# EAGLE schematic Lab2 (EAGLE 6.2)
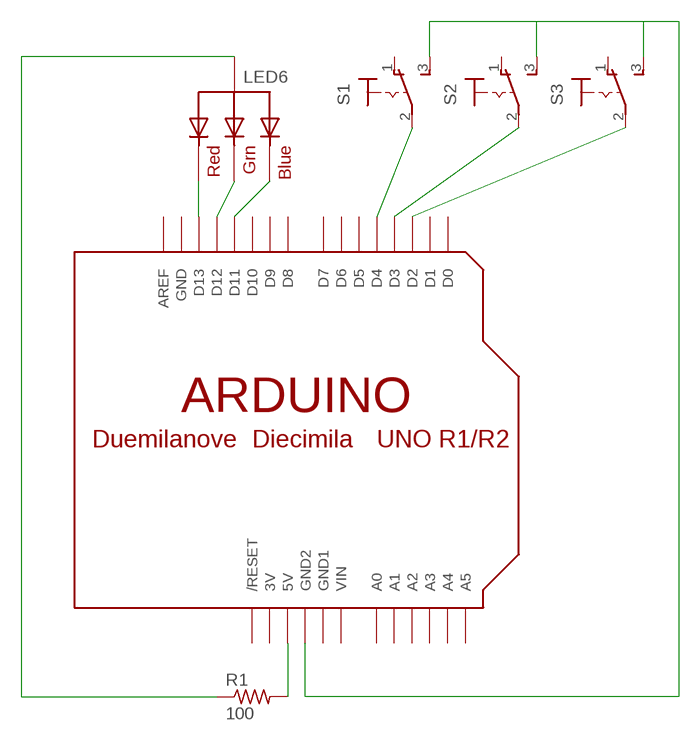
[diagram p0: schematic, sheet 1]

## Parts
LED6  RGBLED_CA-5MM  [LED5MMRGB]
R1  100  R-US_0411/12  [0411/12]
S1  M9040P  [M9040P]
S2  M9040P  [M9040P]
S3  M9040P  [M9040P]
U$1  ARDUINO-BPLACE  [ARDUINO-BPLACE]

## Nets
N$1: LED6.1(RED) U$1.D13
N$2: LED6.3(GREEN) U$1.D12
N$3: LED6.4(BLUE) U$1.D11
N$4: S1.2(P) U$1.D4
N$5: S2.2(P) U$1.D3
N$6: LED6.2(VCC) R1.1
N$7: R1.2 U$1.5V
N$8: S3.2(P) U$1.D2
N$9: S1.3(S) S2.3(S) S3.3(S) U$1.GND2
Unconnected: S1.1(O) S2.1(O) S3.1(O) U$1.A0 U$1.A1 U$1.A2 U$1.A3 U$1.A4 U$1.A5 U$1.AREF U$1.D0 U$1.D1 U$1.D5 U$1.D6 U$1.D7 U$1.D8 U$1.D9 U$1.D10 U$1.RESET(/RESET)

## Power pins joined to a net without a drawn wire
3V: U$1.3V
GND: U$1.GND
GND1: U$1.GND1
VIN: U$1.VIN

## Library data of the parts
LED6 = adafruit:RGBLED_CA: RGB LED, common-anode 5MM Staggered pins 5mm Piranha package http://www.ladyada.net/library/pcb/eaglelibrary.html
R1 = adafruit:R-US_: RESISTOR, American symbol
S1-S3 = switch:M9040P: TOGGLE SWITCH Marquardt
U$1 = adafruit:ARDUINO: Arduino Diecimila/Duemilanove Make a shield with ease, this package has all the named pins as well as the two mounting drill holes and an outline of the USB and DC power connector. The outline is on the DIMENSION layer, so if your board house uses it they will cut the outline to match. http://www.ladyada.net/library/pcb/eaglelibrary.html